# Altium schematic sheet Power.SchDoc: 电源电路
size A4
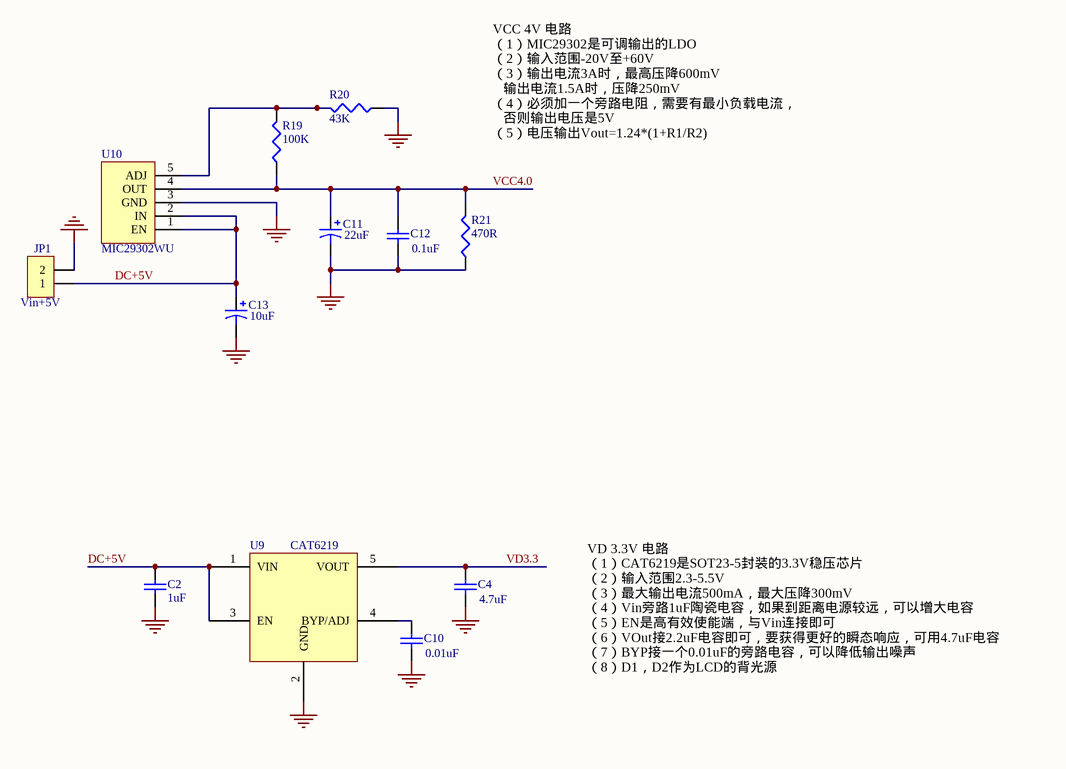
[diagram p0: Power.SchDoc]

## Parts
C2  value 1uF  [1608[0603]]  (hidden comment: Cap Semi)
C4  value 4.7uF  [1608[0603]]  (hidden comment: Cap Semi)
C10  value 0.01uF  [1608[0603]]  (hidden comment: Cap Semi)
C11  value 22uF  [C0805]  (hidden comment: Cap Pol3)
C12  value 0.1uF  [1608[0603]]  (hidden comment: Cap Semi)
C13  value 10uF  [C0805]  (hidden comment: Cap Pol3)
JP1  Vin+5V  [XH2.54-2P]
R19  value 100K  [J1-0603]  (hidden comment: Res3)
R20  value 43K  [J1-0603]  (hidden comment: Res3)
R21  value 470R  [J1-0603]  (hidden comment: Res3)
U9  CAT6219  [SOT23-5]
U10  MIC29302WU  [TO263-5]

## Nets
GND: C2.2 C4.1 C10.1 C11.2 C12.1 C13.2 JP1.2 R20.1 R21.1 U9.2(GND) U10.3(GND)
DC+5V: C2.1 C13.1 JP1.1 U9.1(VIN) U9.3(EN) U10.1(EN) U10.2(IN)
VCC4.0: C11.1 C12.2 R19.1 R21.2 U10.4(OUT)
VD3.3: C4.2 U9.5(VOUT)
NetC10_2: C10.2 U9.4(BYP/ADJ)
NetR19_2: R19.2 R20.2 U10.5(ADJ)

## Notes on the sheet
- VCC 4V 电路
  （1）MIC29302是可调输出的LDO
  （2）输入范围-20V至+60V
  （3）输出电流3A时，最高压降600mV
  输出电流1.5A时，压降250mV
  （4）必须加一个旁路电阻，需要有最小负载电流，
  否则输出电压是5V
  （5）电压输出Vout=1.24*(1+R1/R2)
- VD 3.3V 电路
  （1）CAT6219是SOT23-5封装的3.3V稳压芯片
  （2）输入范围2.3-5.5V
  （3）最大输出电流500mA，最大压降300mV
  （4）Vin旁路1uF陶瓷电容，如果到距离电源较远，可以增大电容
  （5）EN是高有效使能端，与Vin连接即可
  （6）VOut接2.2uF电容即可，要获得更好的瞬态响应，可用4.7uF电容
  （7）BYP接一个0.01uF的旁路电容，可以降低输出噪声
  （8）D1，D2作为LCD的背光源

## Library data of the parts
C2 C4 C10 C12 = Cap Semi: Capacitor (Semiconductor SIM Model); Published: 8-Jun-2000; LatestRevisionDate: 29-May-2009; LatestRevisionNote: IPC-7351 Footprint Added.; PackageReference: C1206; Publisher: Altium Limited; PackageDescription: Chip Capacitor
C11 C13 = Cap Pol3: Polarized Capacitor (Surface Mount); Published: 8-Jun-2000; LatestRevisionDate: 29-May-2009; LatestRevisionNote: IPC-7351 Footprint Added.; PackageReference: C0805; Publisher: Altium Limited; PackageDescription: Chip Capacitor
JP1 = Header 2: 2P接插件; 版权归属: 源创客; BOM名称: 2P接插件; 学习资源: www.ooocke.com
R19-R21 = Res3: Resistor; Published: 8-Jun-2000; LatestRevisionDate: 29-May-2009; LatestRevisionNote: IPC-7351 Footprint Added.; PackageReference: J1-0603; Publisher: Altium Limited; PackageDescription: Chip Resistor
U9 = CAT6219: 500 mA CMOS LDO Regulator
U10 = MIC29302WU: 2A,  adjustable LDO